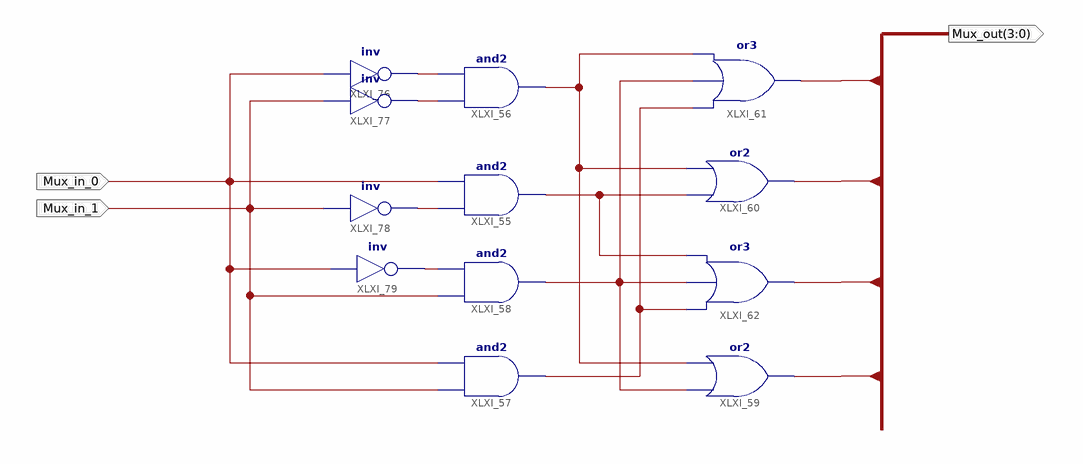
[diagram p0: schematic sheet 1]
// Xilinx ISE schematic EX1_MUX_2.sch (spartan3e) as structural Verilog: 12 symbols, 3 ports
module EX1_MUX_2 (
  input  Mux_in_0,
  input  Mux_in_1,
  output [3:0] Mux_out
);

  wire XLXN_3, XLXN_4, XLXN_5, XLXN_6, XLXN_7, XLXN_9, XLXN_10, XLXN_22;

  not XLXI_76 (XLXN_4, Mux_in_0);
  not XLXI_77 (XLXN_3, Mux_in_1);
  not XLXI_78 (XLXN_5, Mux_in_1);
  not XLXI_79 (XLXN_6, Mux_in_0);
  and XLXI_56 (XLXN_7, XLXN_3, XLXN_4);
  and XLXI_55 (XLXN_10, XLXN_5, Mux_in_0);
  and XLXI_58 (XLXN_9, Mux_in_1, XLXN_6);
  and XLXI_57 (XLXN_22, Mux_in_1, Mux_in_0);
  or XLXI_61 (Mux_out[0], XLXN_22, XLXN_9, XLXN_7);
  or XLXI_59 (Mux_out[3], XLXN_9, XLXN_7);
  or XLXI_60 (Mux_out[1], XLXN_10, XLXN_7);
  or XLXI_62 (Mux_out[2], XLXN_22, XLXN_9, XLXN_10);
endmodule
